# Altium schematic sheet power.SchDoc
size A4
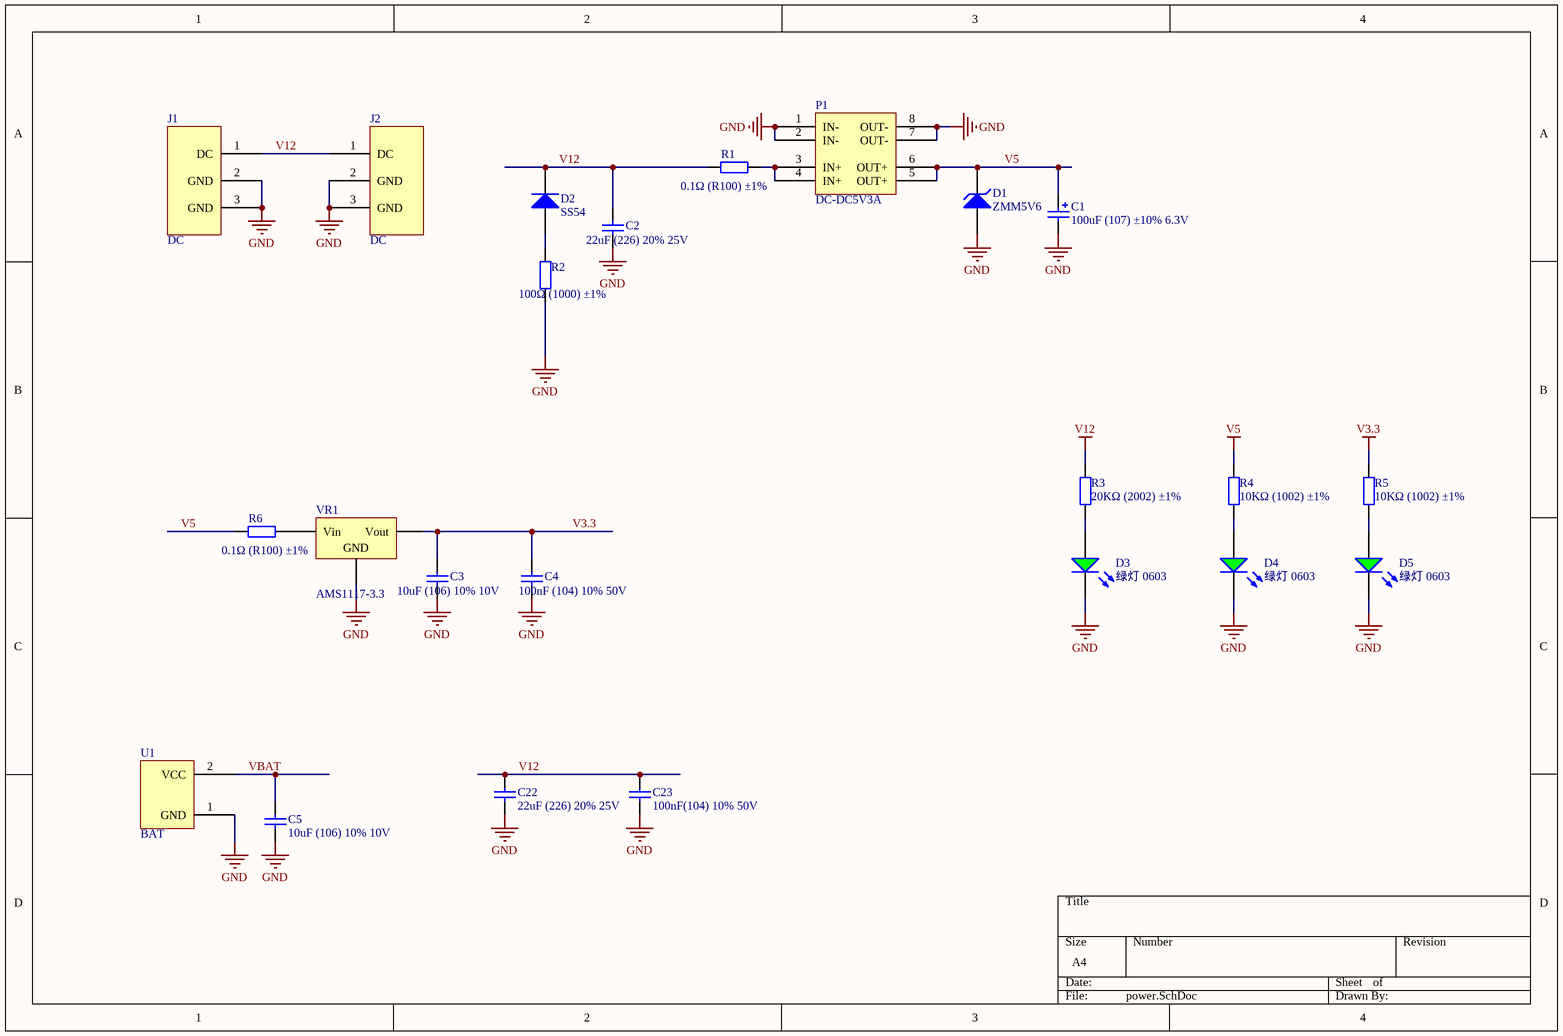
[diagram p0: power.SchDoc]

## Parts
C1  100uF (107) ±10% 6.3V  [CASE-B_3528]
C2  22uF (226) 20% 25V  [0805_C]
C3  10uF (106) 10% 10V  [0603_C]
C4  100nF (104) 10% 50V  [0603_C]
C5  10uF (106) 10% 10V  [0603_C]
C22  22uF (226) 20% 25V  [0805_C]
C23  100nF(104) 10% 50V  [0805_C]
D1  ZMM5V6  [LL-34]
D2  SS54  [SMA(DO-214AC)_S1]
D3  绿灯 0603  [0603_LED_S1]
D4  绿灯 0603  [0603_LED_S1]
D5  绿灯 0603  [0603_LED_S1]
J1  DC  [DC005]
J2  DC  [DC005]
P1  DC-DC5V3A  [DC-DC3A]
R1  0.1Ω (R100) ±1%  [1206_R]
R2  100Ω (1000) ±1%  [0805_R]
R3  20KΩ (2002) ±1%  [0603_R]
R4  10KΩ (1002) ±1%  [0603_R]
R5  10KΩ (1002) ±1%  [0603_R]
R6  0.1Ω (R100) ±1%  [1206_R]
U1  BAT  [BAT2032]
VR1  AMS1117-3.3  [SOT-223]

## Nets
GND: C1.2 C2.1 C3.1 C4.1 C5.1 C22.1 C23.1 D1.1(A) D3.K D4.K D5.K J1.2(GND) J1.3(GND) J2.2(GND) J2.3(GND) P1.1(IN-) P1.2(IN-) P1.7(OUT-) P1.8(OUT-) R2.1 U1.1(GND) VR1.1(GND)
V3.3: C3.2 C4.2 R5.2 VR1.2(Vout)
V5: C1.1 D1.2(K) P1.5(OUT+) P1.6(OUT+) R4.2 R6.1
V12: C2.2 C22.2 C23.2 D2.2(K) J1.1(DC) J2.1(DC) R1.1 R3.2
VBAT: C5.2 U1.2(VCC)
NetD2_1: D2.1(A) R2.2
NetD3_A: D3.A R3.1
NetD4_A: D4.A R4.1
NetD5_A: D5.A R5.1
NetP1_3: P1.3(IN+) P1.4(IN+) R1.2
NetR6_2: R6.2 VR1.3(Vin)

## Library data of the parts
C1 = 3528 100uF (107) 10% 6.3V: 钽电容; ComponentLink1Description: 供应商链接; ComponentLink1URL: http://www.szlcsc.com/product/details_16815.html; Package: 3528; Supplier: LC; SuppliersPartNumber: C16133
C2 C22 = 0805 22uF (226) 20% 25V: 贴片电容; ComponentLink1Description: 供应商链接; ComponentLink1URL: http://www.szlcsc.com/product/details_46786.html; Package: 0805; Supplier: LC; SuppliersPartNumber: C45783
C3 C5 = 0603 10uF (106) 10% 10V: 贴片电容; ComponentLink1Description: 供应商链接; ComponentLink1URL: http://www.szlcsc.com/product/details_20411.html; Package: 0603; Supplier: LC; SuppliersPartNumber: C19702
C4 = 0603 100nF (104) 10% 50V: 贴片电容; ComponentLink1Description: 供应商链接; ComponentLink1URL: http://www.szlcsc.com/product/details_15331.html; Package: 0603; Supplier: LC; SuppliersPartNumber: C14663
C23 = 0805 100nF(104) 10% 50V: 贴片电容; ComponentLink1Description: 供应商链接; ComponentLink1URL: http://www.szlcsc.com/product/details_50686.html; Package: 0805; Supplier: LC; SuppliersPartNumber: C49678
D1 = LL-34 ZMM5V6: 稳压二极管; ComponentLink1Description: 供应商链接; ComponentLink1URL: http://www.szlcsc.com/product/details_8541.html; Package: LL-34; Supplier: LC; SuppliersPartNumber: C8062
D2 = SMA(DO-214AC) SS54: 二极管; ComponentLink1Description: 供应商链接; ComponentLink1URL: http://www.szlcsc.com/product/details_23178.html; Package: SMA(DO-214AC); Supplier: LC; SuppliersPartNumber: C22452
D3-D5 = 0603 绿灯: 发光二极管; ComponentLink1Description: 供应商链接; ComponentLink1URL: http://www.szlcsc.com/product/details_73152.html; Package: 0603; Supplier: LC; SuppliersPartNumber: C72043
J1 J2 = DC: Connector for DC 12V
P1 = DC-DC3A
R1 R6 = 1206 0.1Ω (R100) 1%: 贴片电阻; ComponentLink1Description: 供应商链接; ComponentLink1URL: http://www.szlcsc.com/product/details_26077.html; Package: 1206; Supplier: LC; SuppliersPartNumber: C25334
R2 = 0805 100Ω (1000) 1%: 贴片电阻; ComponentLink1Description: 供应商链接; ComponentLink1URL: http://www.szlcsc.com/product/details_18096.html; Package: 0805; Supplier: LC; SuppliersPartNumber: C17408
R3 = 0603 20KΩ (2002) 1%: 贴片电阻; ComponentLink1Description: 供应商链接; ComponentLink1URL: http://www.szlcsc.com/product/details_4591.html; Package: 0603; Supplier: LC; SuppliersPartNumber: C4184
R4 R5 = 0603 10KΩ (1002) 1%: 贴片电阻; ComponentLink1Description: 供应商链接; ComponentLink1URL: http://www.szlcsc.com/product/details_26547.html; Package: 0603; Supplier: LC; SuppliersPartNumber: C25804
U1 = BAT2032
VR1 = SOT-223 AMS1117-3.3: 低压差线性稳压(LDO); ComponentLink1Description: 供应商链接; ComponentLink1URL: http://www.szlcsc.com/product/details_6652.html; Package: SOT-223; Supplier: LC; SuppliersPartNumber: C6186